# EAGLE design 3w-rgb-led-connector-mk-6.1 (EAGLE 6.5.0)
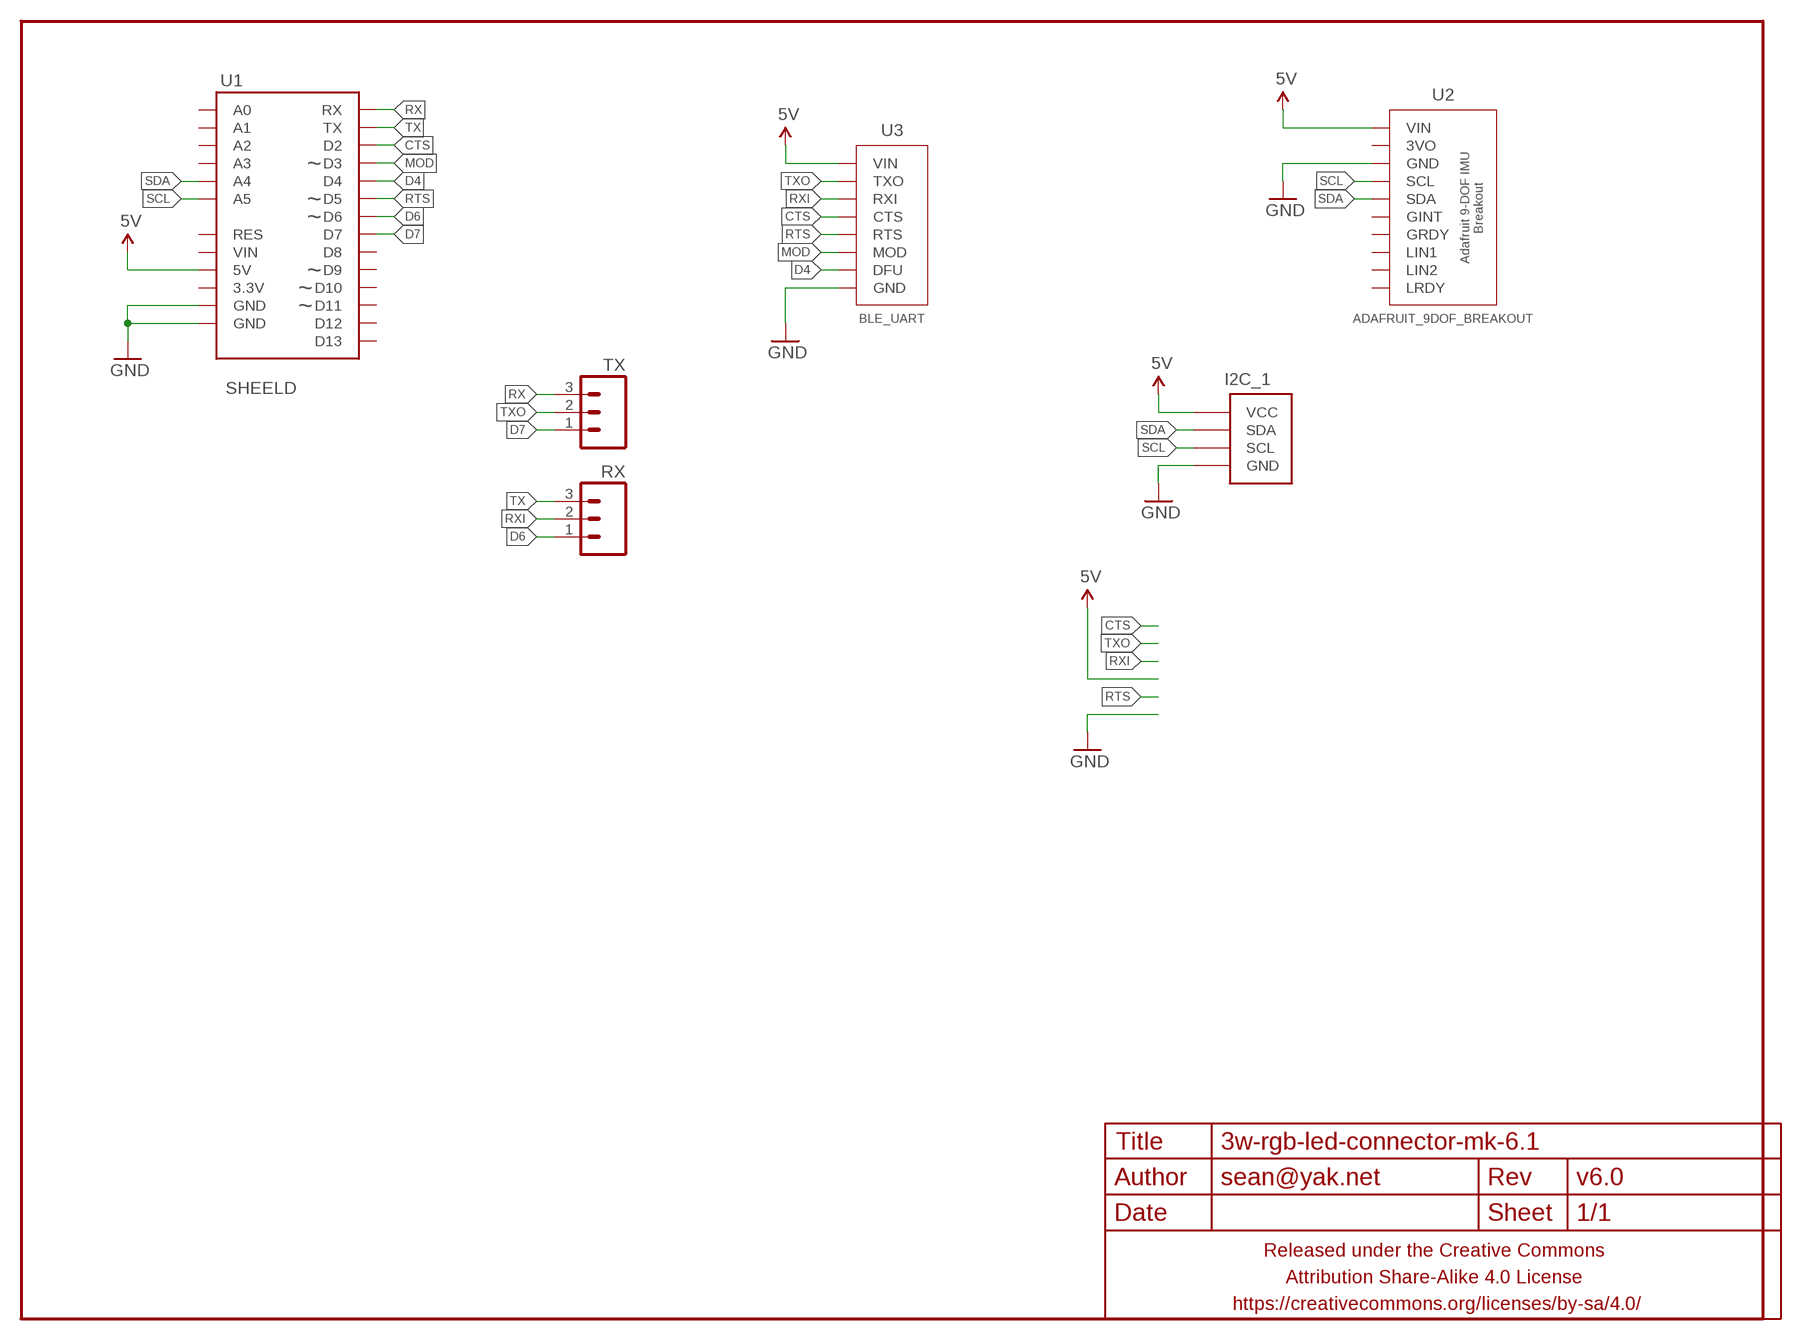
[diagram p0: schematic, sheet 1]

## Parts
FRAME1  FRAME-LETTERNO_PACKAGE  [DUMMY]
I2C_1  M04-I2CPTH-0.1IN  [1X04-PTH-VERT-I2C]
RX  M03PTH-CENTERED  [1X03-CENTERED]
TX  M03PTH-CENTERED  [1X03-CENTERED]
U1  SHEELD  ARDUINO_SHIELD_SMALLER  [ARDUINO_SHIELD_NOOUTLINE_INSIDE_SMALLER]
U2  ADAFRUIT_9DOF_BREAKOUT  [ADAFRUIT_9DOF_BREAKOUT]
U3  BLE_UART  ADAFRUIT_BLE_UARTLESSBARE  [ADAFRUIT_BLE_UART_NOTHOLEY]

## Nets
5V: I2C_1.VCC U1.5V U2.VIN U3.VIN
CTS: U1.D2 U3.CTS
D4: U1.D4 U3.DFU
D6: RX.1 U1.D6
D7: TX.1 U1.D7
GND: I2C_1.GND U1.GND@0(GND) U1.GND@1(GND) U2.GND U3.GND
MOD: U1.D3 U3.MOD
RTS: U1.D5 U3.RTS
RX: TX.3 U1.RX
RXI: RX.2 U3.RXI
SCL: I2C_1.SCL U1.A5 U2.SCL
SDA: I2C_1.SDA U1.A4 U2.SDA
TX: RX.3 U1.TX
TXO: TX.2 U3.TXO
Unconnected: U1.3.3V U1.A0 U1.A1 U1.A2 U1.A3 U1.D8 U1.D9 U1.D10 U1.D11 U1.D12 U1.D13 U1.RES U1.VIN U2.3VO U2.GINT U2.GRDY U2.LIN1 U2.LIN2 U2.LRDY

## Library data of the parts
FRAME1 = A_butts:FRAME-LETTER: Schematic Frame Standard 8.5x11 US Letter frame; DESIGNER: sean@yak.net; VERSION: v6.0
I2C_1 = A_butts:M04-I2C
RX TX = A_butts:M03: Header 3 Standard 3-pin 0.1" header. Use with straight break away headers (SKU : PRT-00116), right angle break away headers (PRT-00553), swiss pins (PRT-00743), machine pins (PRT-00117), and female headers (PRT-00115). Molex polarized connector foot print use with SKU : PRT-08232 with associated crimp pins and housings.
U1 = A_butts:ARDUINO_SHIELD_SMALLER
U2 = A_butts:ADAFRUIT_9DOF_BREAKOUT
U3 = A_butts:ADAFRUIT_BLE_UART

## Board
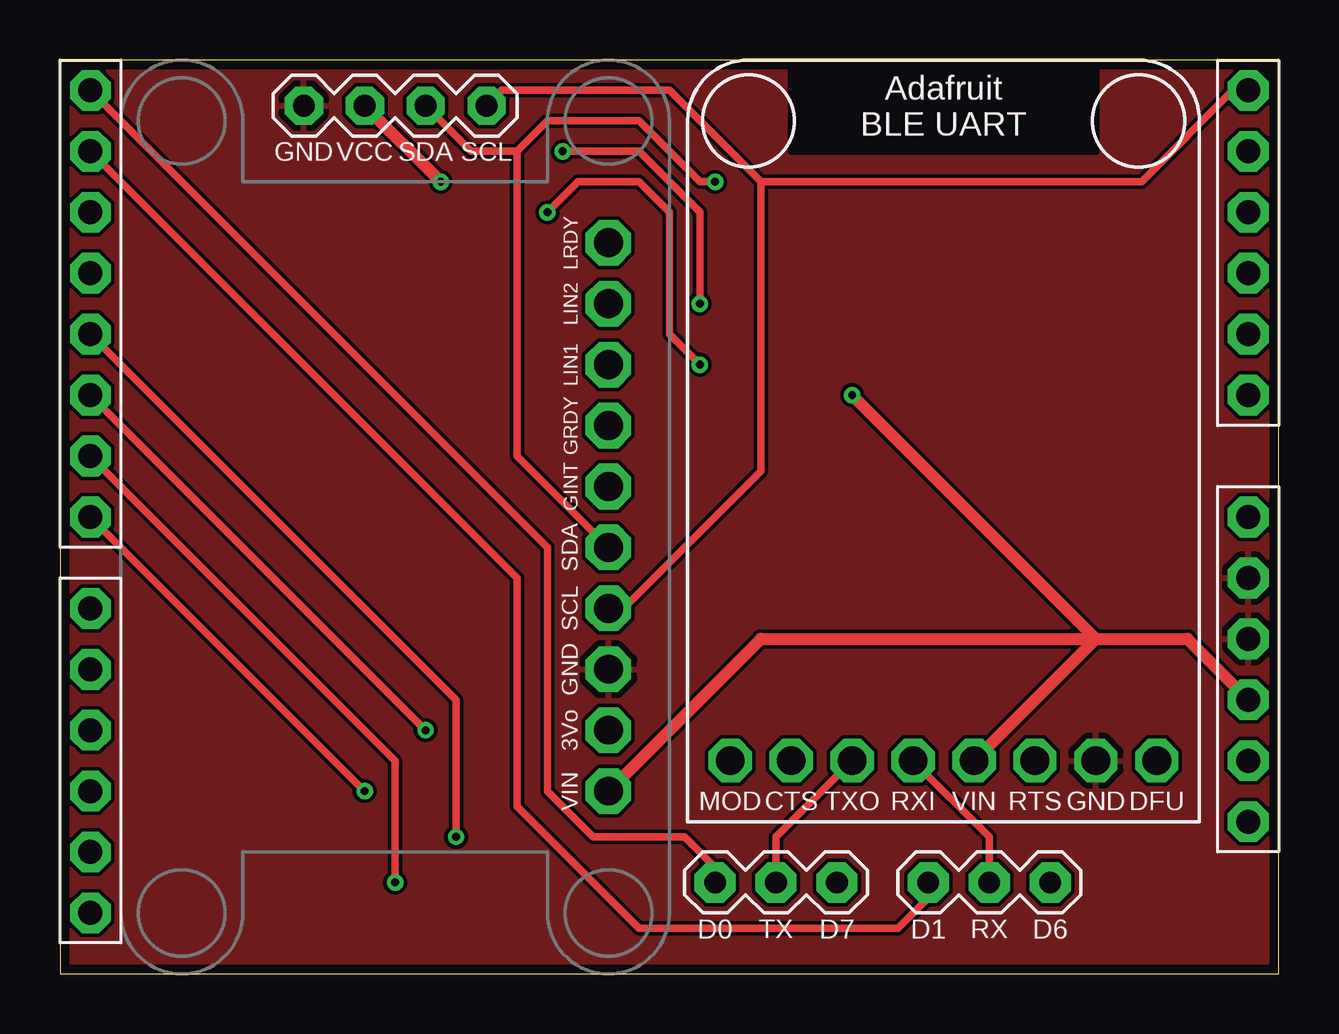
[diagram p1: board, top side]
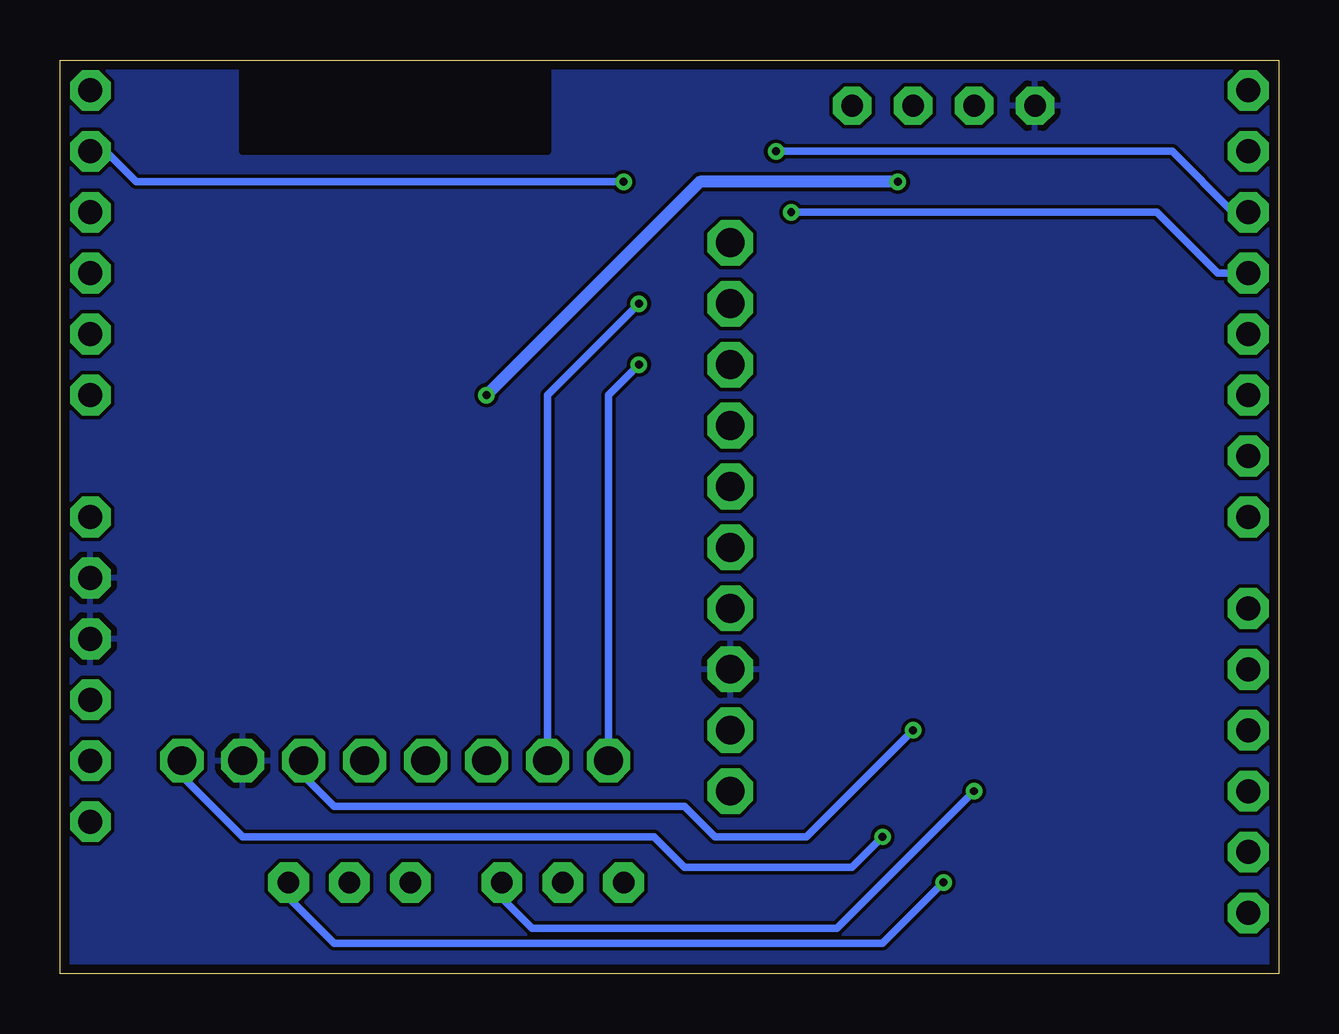
[diagram p2: board, bottom side, seen from below]

Size 50.8 x 38.1 mm. Coordinates in mm from the lower left corner, seen from the top.
Outline: 0,0 50.8,0 50.8,38.1 0,38.1 0,0
Copper layers (1*16): Top 0.0356mm / dielectric 1.5011mm / Bottom 0.0356mm
Design rules "LaenPCBOrder_2": minimum track width 6mil, minimum drill 13mil, track to track 6mil, track to pad 6mil, pad to pad 6mil, via to via 6mil, smd to smd 6mil, copper to edge 15mil, drill to drill 6mil, minimum pad ring 7mil, minimum via ring 7mil, stop-mask expansion 3mil, vias tented up to drill 20mil, thermal gap 10mil

### Footprints (pad centres in the part's own frame; a part is rotated, then mirrored left to right if it is on the bottom)
1X04-PTH-VERT-I2C = drill 0.9 pad 1.6 octagon: GND 0,0; SCL 7.62,0; SDA 5.08,0; VCC 2.54,0
1X03-CENTERED = drill 0.9 pad 1.7 octagon: 1 -2.54,0; 2 0,0; 3 2.54,0
ARDUINO_SHIELD_NOOUTLINE_INSIDE_SMALLER = drill 1 pad 1.7 octagon: 3.3V 48.26,-27.94; 5V 48.26,-25.4; A0 48.26,-12.7; A1 48.26,-10.16; A2 48.26,-7.62; A3 48.26,-5.08; A4 48.26,-2.54; A5 48.26,0; D2 0,-5.08; D3 0,-7.62; D4 0,-10.16; D5 0,-12.7; D6 0,-15.24; D7 0,-17.78; D8 0,-21.59; D9 0,-24.13; D10 0,-26.67; D11 0,-29.21; D12 0,-31.75; D13 0,-34.29; GND@0 48.26,-22.86; GND@1 48.26,-20.32; RES 48.26,-30.48; RX 0,0; TX 0,-2.54; VIN 48.26,-17.78
ADAFRUIT_9DOF_BREAKOUT = drill 1.2 pad 1.9 octagon: 3VO -8.89,0; GINT 1.27,0; GND -6.35,0; GRDY 3.81,0; LIN1 6.35,0; LIN2 8.89,0; LRDY 11.43,0; SCL -3.81,0; SDA -1.27,0; VIN -11.43,0
ADAFRUIT_BLE_UART_NOTHOLEY = drill 1.2 pad 1.8 octagon: CTS -6.35,0; DFU 8.89,0; GND 6.35,0; MOD -8.89,0; RTS 3.81,0; RXI -1.27,0; TXO -3.81,0; VIN 1.27,0

### Placement (x,y rotation side)
FRAME1  0,0 0 top
I2C_1  10.16,36.2 0 top
RX  38.73,3.81 180 top
TX  29.84,3.81 180 top
U1  1.27,36.83 0 top
U2  22.86,19.05 90 top
U3  36.83,8.89 0 top

### Tracks (layer width: path | path; a pad name or v marks a point on that pad's centre or on a via)
5V  (via drill 0.33)
  Top 0.508: I2C_1.VCC v15.88,33.02 | v33.02,24.13 43.18,13.97 | U1.5V 46.99,13.97 43.18,13.97 | U2.VIN 29.21,13.97 43.18,13.97 | U3.VIN 43.18,13.97
  Bottom 0.508: v15.88,33.02 24.13,33.02 v33.02,24.13
CTS  (via drill 0.33)
  Top 0.305: v20.95,34.29 24.13,34.29 26.67,31.75 v26.67,27.94
  Bottom 0.305: U1.D2 1.91,31.75 4.45,34.29 v20.95,34.29 | v26.67,27.94 30.48,24.13 U3.CTS
D4  (via drill 0.33)
  Top 0.305: U1.D4 16.51,11.43 v16.51,5.71
  Bottom 0.305: U3.DFU 45.72,8.26 43.18,5.71 26.04,5.71 24.77,4.45 17.78,4.45 v16.51,5.71
D6  (via drill 0.33)
  Top 0.305: U1.D6 13.97,8.89 v13.97,3.81
  Bottom 0.305: v13.97,3.81 16.51,1.27 39.37,1.27 41.27,3.17 RX.1
D7  (via drill 0.33)
  Top 0.305: U1.D7 v12.7,7.62
  Bottom 0.305: v12.7,7.62 18.41,1.91 31.11,1.91 32.38,3.17 TX.1
GND
  pour Top (isolate 0.152): 0,38.1 50.8,38.1 50.8,0 0,0
  pour Bottom (isolate 0.152): 0,0 0,38.1 50.8,38.1 50.8,0
MOD  (via drill 0.33)
  Top 0.305: v20.32,31.75 21.59,33.02 24.13,33.02 25.4,31.75 25.4,26.67 v26.67,25.4
  Bottom 0.305: U1.D3 2.54,29.21 5.08,31.75 v20.32,31.75 | v26.67,25.4 27.94,24.13 U3.MOD
RTS  (via drill 0.33)
  Top 0.305: U1.D5 v15.24,10.16
  Bottom 0.305: U3.RTS 40.64,8.26 39.37,6.99 24.77,6.99 23.5,5.71 19.68,5.71 v15.24,10.16
RX
  Top 0.305: U1.RX 20.32,17.78 20.32,7.62 22.23,5.71 26.04,5.71 27.3,4.45 TX.3
RXI
  Top 0.305: RX.2 38.73,5.71 U3.RXI
SCL
  Top 0.305: U1.A5 48.9,36.83 45.09,33.02 29.21,33.02 | 29.21,33.02 25.4,36.83 18.41,36.83 I2C_1.SCL | U2.SCL 23.5,15.24 29.21,20.95 29.21,33.02
SDA  (via drill 0.33)
  Top 0.305: v27.3,33.02 26.67,33.02 24.13,35.56 20.32,35.56 19.05,34.29 | 19.05,34.29 17.14,34.29 I2C_1.SDA | U2.SDA 19.05,21.59 19.05,34.29
  Bottom 0.305: U1.A4 48.9,34.29 47.62,33.02 v27.3,33.02
TX
  Top 0.305: U1.TX 19.05,16.51 19.05,6.99 24.13,1.91 34.92,1.91 36.2,3.17 RX.3
TXO
  Top 0.305: TX.2 29.84,5.71 U3.TXO

### Text on the board
tPlace: Das Blinkenskirt! | D0 | D7 | D1 | D6